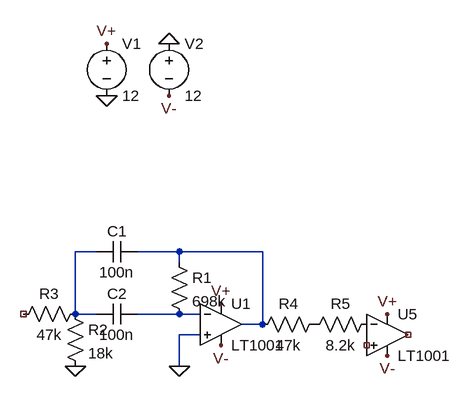
[diagram p0: schematic Draft1.asc]
Draft1.asc, the LTspice schematic file:
Version 4
SHEET 1 1196 680
WIRE -16 64 -48 64
WIRE 112 64 48 64
WIRE 240 64 112 64
WIRE 112 80 112 64
WIRE -48 160 -48 64
WIRE -16 160 -48 160
WIRE 112 160 48 160
WIRE 144 160 112 160
WIRE 240 176 240 64
WIRE 240 176 208 176
WIRE 144 192 112 192
WIRE 112 240 112 192
FLAG -48 240 0
FLAG 112 240 0
FLAG 0 -176 0
FLAG 96 -256 0
FLAG 0 -256 V+
FLAG 96 -176 V-
FLAG 176 144 V+
FLAG 176 208 V-
FLAG 432 160 V+
FLAG 432 224 V-
SYMBOL OpAmps\\LT1001 176 112 R0
SYMATTR InstName U1
SYMBOL res 96 64 R0
SYMATTR InstName R1
SYMATTR Value 698k
SYMBOL cap 48 48 R90
WINDOW 0 0 32 VBottom 2
WINDOW 3 32 32 VTop 2
SYMATTR InstName C1
SYMATTR Value 100n
SYMBOL cap 48 144 R90
WINDOW 0 0 32 VBottom 2
WINDOW 3 32 32 VTop 2
SYMATTR InstName C2
SYMATTR Value 100n
SYMBOL res -64 144 R0
SYMATTR InstName R2
SYMATTR Value 18k
SYMBOL res -32 144 R90
WINDOW 0 0 56 VBottom 2
WINDOW 3 32 56 VTop 2
SYMATTR InstName R3
SYMATTR Value 47k
SYMBOL voltage 0 -272 R0
WINDOW 123 0 0 Left 0
WINDOW 39 0 0 Left 0
SYMATTR InstName V1
SYMATTR Value 12
SYMBOL voltage 96 -272 R0
WINDOW 123 0 0 Left 0
WINDOW 39 0 0 Left 0
SYMATTR InstName V2
SYMATTR Value 12
SYMBOL res 336 160 R90
WINDOW 0 0 56 VBottom 2
WINDOW 3 32 56 VTop 2
SYMATTR InstName R4
SYMATTR Value 47k
SYMBOL res 416 160 R90
WINDOW 0 0 56 VBottom 2
WINDOW 3 32 56 VTop 2
SYMATTR InstName R5
SYMATTR Value 8.2k
SYMBOL OpAmps\\LT1001 432 128 R0
SYMATTR InstName U5

The netlist it stands for:
* Draft1.asc
XU1 0 N003 V+ V- N002 LT1001  ; pins In+ In- V+ V- OUT
R1 N002 N003 698k
C1 N002 N001 100n
C2 N003 N001 100n
R2 N001 0 18k
R3 N001 NC_01 47k
V1 V+ 0 12
V2 0 V- 12
R4 P001 N002 47k
R5 P002 P001 8.2k
XU5 NC_02 P002 V+ V- NC_03 LT1001  ; pins In+ In- V+ V- OUT
.lib LTC.lib
.backanno
.end